# Altium schematic sheet FrameBuffAddressCheck.SchDoc
size A4; DocumentNumber: 7; SheetNumber: 7; SheetTotal: 10
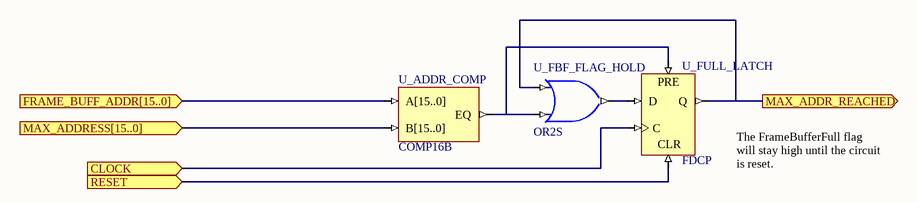
[diagram p0: FrameBuffAddressCheck.SchDoc]

## Parts
U_ADDR_COMP  COMP16B
U_FBF_FLAG_HOLD  OR2S
U_FULL_LATCH  FDCP

## Ports
CLOCK (in), FRAME_BUFF_ADDR[15..0] (in), MAX_ADDR_REACHED (out), MAX_ADDRESS[15..0] (in), RESET (in)

## Nets
CLOCK: U_FULL_LATCH.C ; port CLOCK
FRAME_BUFF_ADDR[15..0]: U_ADDR_COMP.A[15..0] ; port FRAME_BUFF_ADDR[15..0]
MAX_ADDR_REACHED: U_FBF_FLAG_HOLD.I0 U_FULL_LATCH.Q ; port MAX_ADDR_REACHED
MAX_ADDRESS[15..0]: U_ADDR_COMP.B[15..0] ; port MAX_ADDRESS[15..0]
RESET: U_FULL_LATCH.CLR ; port RESET
NetU_ADDR_COMP_EQ: U_ADDR_COMP.EQ U_FBF_FLAG_HOLD.I1 U_FULL_LATCH.PRE
NetU_FBF_FLAG_HOLD_O: U_FBF_FLAG_HOLD.O U_FULL_LATCH.D

## Notes on the sheet
- (near U_FULL_LATCH) The FrameBufferFull flag will stay high until the circuit is reset.

## Library data of the parts
U_ADDR_COMP = COMP16B: 16-Bit Identity Comparator, Bus Version; Xilinx Equivalent: COMP16; ArchiveName: GENERIC; VHDLIB_SIM: GENERIC_LIB; Published: 29-Jan-2004; Publisher: Altium Limited; Core Revision: 1.00.00
U_FBF_FLAG_HOLD = OR2S: 2-Input OR Gate, Single Pin Version; Xilinx Equivalent: OR2; ArchiveName: GENERIC; VHDLIB_SIM: GENERIC_LIB; Published: 29-Jan-2004; Publisher: Altium Limited; Core Revision: 1.00.00
U_FULL_LATCH = FDCP: D-Type Flip-Flop with Asynchronous Preset and Clear; ArchiveName: GENERIC; VHDLIB_SIM: GENERIC_LIB; Published: 29-Jan-2004; Publisher: Altium Limited; Xilinx Equivalent: FDCP; Core Revision: 1.00.00